# Altium schematic sheet Power.SchDoc
size 279 x 215 mm; Engineer: Andrew Chai
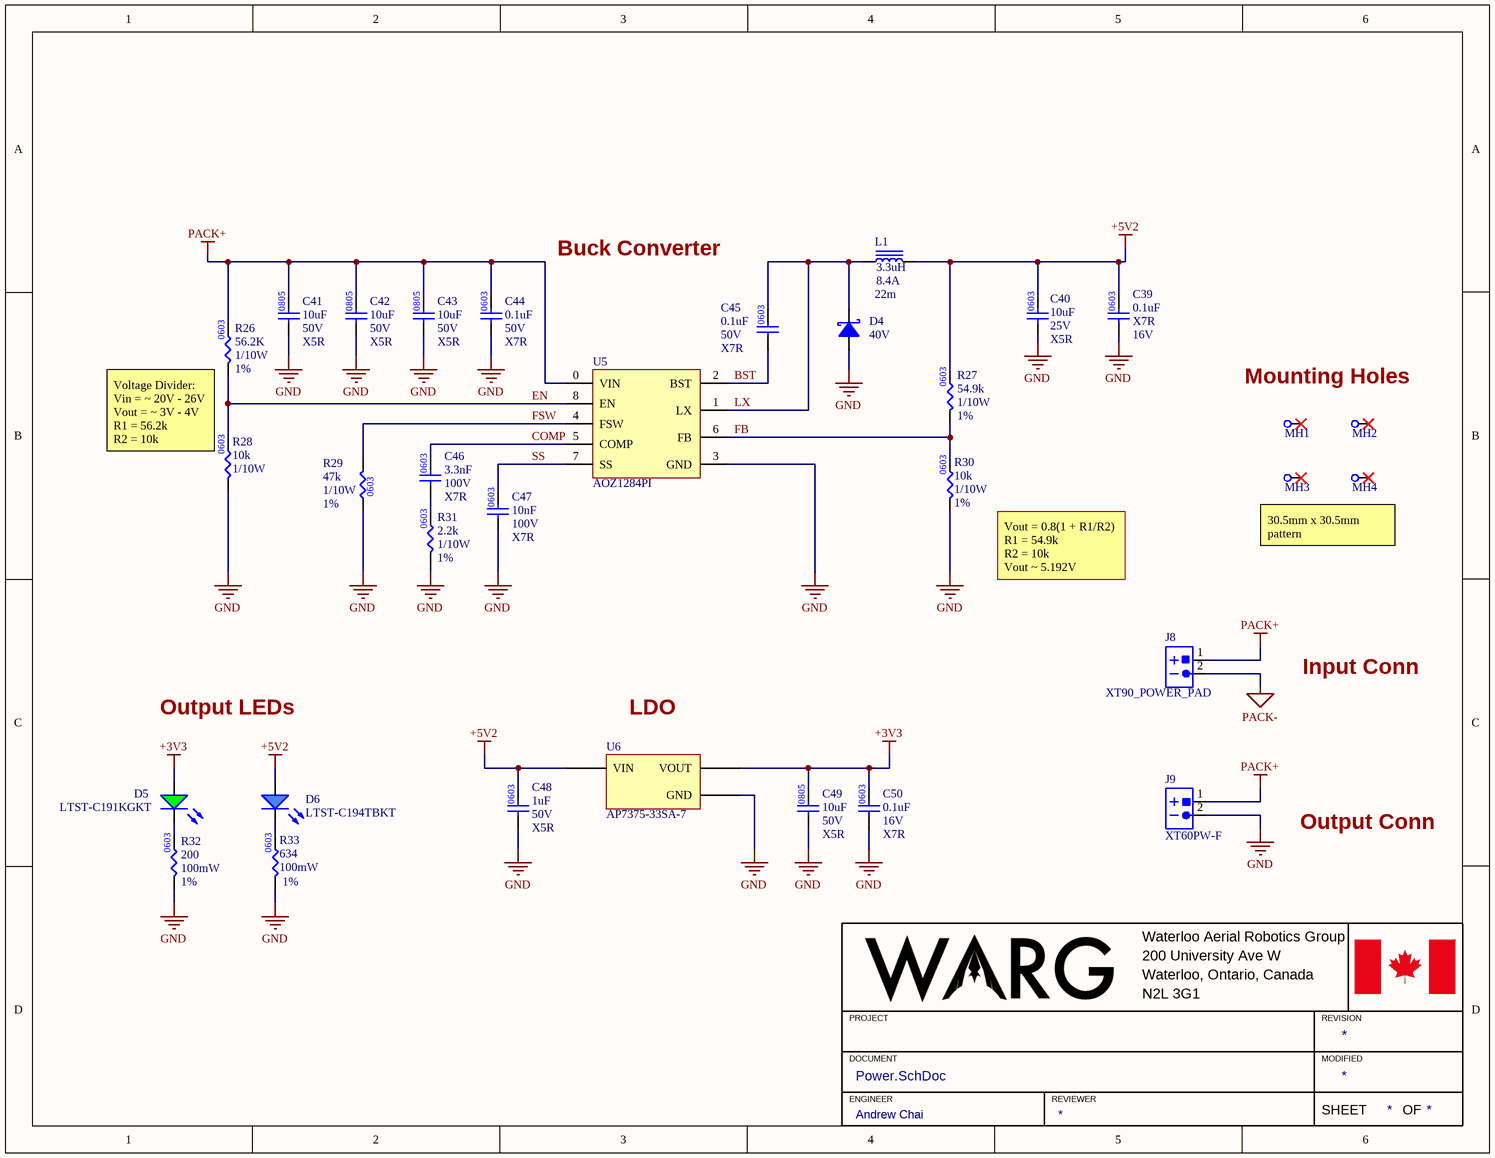
[diagram p0: Power.SchDoc]

## Parts
C39  value 0.1uF  Temperature Coefficient: X7R  Voltage: 16V  [.CAP_0603-Footprint-1]  (hidden comment: GCM188R71C104KA37D)
C40  value 10uF  Voltage Rating: 25V  Temperature Coefficient: X5R  [.CAP_0603-Footprint-1]  (hidden comment: GRM188R61E106KA73J)
C41  value 10uF  Voltage Rating: 50V  Dielectric: X5R  [.CAP_0805-Footprint-1]  (hidden comment: GRM21BR61H106KE43L)
C42  value 10uF  Voltage Rating: 50V  Dielectric: X5R  [.CAP_0805-Footprint-1]  (hidden comment: GRM21BR61H106KE43L)
C43  value 10uF  Voltage Rating: 50V  Dielectric: X5R  [.CAP_0805-Footprint-1]  (hidden comment: GRM21BR61H106KE43L)
C44  Voltage: 50V  Dielectric: X7R  Capacitance: 0.1uF  [CAP0603]  (hidden comment: GCM188R71H104KA57D)
C45  Voltage: 50V  Dielectric: X7R  Capacitance: 0.1uF  [CAP0603]  (hidden comment: GCM188R71H104KA57D)
C46  value 3.3nF  Temperature Characteristics Code: X7R  Rated DC Voltage (URdc): 100V  [.CAP_0603-Footprint-1]  (hidden comment: GCM188R72A332KA37D)
C47  value 10nF  Rated DC Voltage (URdc): 100V  Temperature Characteristics Code: X7R  [CAP0603]  (hidden comment: GCM188R72A103KA37D)
C48  value 1uF  Voltage Rating: 50V  Temperature Characteristics Code: X5R  [.CAP_0603-Footprint-1]  (hidden comment: GRT188R61H105KE13D)
C49  value 10uF  Voltage Rating: 50V  Dielectric: X5R  [.CAP_0805-Footprint-1]  (hidden comment: GRM21BR61H106KE43L)
C50  value 0.1uF  Temperature Coefficient: X7R  Voltage: 16V  [.CAP_0603-Footprint-1]  (hidden comment: GCM188R71C104KA37D)
D4  Max Reverse Voltage (DC): 40V  [DIOM4426X24N]  (hidden comment: SK54A-LTP)
D5  LTST-C191KGKT  [.LED_0603-Footprint-1]
D6  LTST-C194TBKT  [LTST-C194TBKT-Footprint-1]
J8  XT90_POWER_PAD  [XT90_POWER_PAD-Footprint-1]
J9  XT60PW-F  [XT60PW-F-Footprint-1]
L1  DC Resistance: 22m  Current: 8.4A  Inductance: 3.3uH  [0630CDMCCDS-3R3MC-Footprint-1]  (hidden comment: 0630CDMCCDS-3R3MC)
MH1  M2HOLE-STANDARD  [M2HOLE-STANDARD-Footprint-1]  (value not drawn)
MH2  M2HOLE-STANDARD  [M2HOLE-STANDARD-Footprint-1]  (value not drawn)
MH3  M2HOLE-STANDARD  [M2HOLE-STANDARD-Footprint-1]  (value not drawn)
MH4  M2HOLE-STANDARD  [M2HOLE-STANDARD-Footprint-1]  (value not drawn)
R26  value 56.2K  Power: 1/10W  Tolerance: 1%  [.RES_0603-Footprint-1]  (hidden comment: RC0603FR-0756K2L)
R27  Power Rating: 1/10W  Resistance: 54.9k  Tolerance: 1%  [.RES_0603-Footprint-1]  (hidden comment: RC0603FR-0754K9L)
R28  value 10k  Power: 1/10W  [.RES_0603-Footprint-1]  (hidden comment: RC0603FR-0710KL)
R29  value 47k  POWER: 1/10W  TOLERANCE: 1%  [RC0603FR-0756K2L-Footprint-1]  (hidden comment: RC0603FR-0747KL)
R30  value 10k  Power: 1/10W  Tolerance: 1%  [.RES_0603-Footprint-1]  (hidden comment: RC0603FR-0710KL)
R31  value 2.2k  Resistance Tolerance: 1%  Max Power Dissipation: 1/10W  [.RES_0603-Footprint-1]  (hidden comment: RC0603FR-072K2L)
R32  Tolerance: 1%  Power Rating: 100mW  Resistance: 200  [.RES_0603-Footprint-1]  (hidden comment: RC0603FR-07200RL)
R33  value 634  Tolerance: 1%  Power: 100mW  [.RES_0603-Footprint-1]  (hidden comment: RC0603FR-07634RL)
U5  AOZ1284PI  [AOZ1284PI-Footprint-1]
U6  AP7375-33SA-7  [AP7375-33SA-7-Footprint-1]

## Nets
+3V3: C49.2 C50.2 D5.1(A) U6.2(VOUT)
+5V2: C39.2 C40.2 C48.2 D6.1(A) L1.2 R27.2 U6.1(VIN)
GND: C39.1 C40.1 C41.1 C42.1 C43.1 C44.1 C47.1 C48.1 C49.1 C50.1 D4.1(Anode) J9.2 R28.1 R29.1 R30.1 R31.1 R32.1 R33.1 U5.3(GND) U6.3(GND)
PACK+: C41.2 C42.2 C43.2 C44.2 J8.1 J9.1 R26.2 U5.0(VIN)
PACK-: J8.2
BST: C45.1 U5.2(BST)
COMP: C46.2 U5.5(COMP)
EN: R26.1 R28.2 U5.8(EN)
FB: R27.1 R30.2 U5.6(FB)
FSW: R29.2 U5.4(FSW)
LX: C45.2 D4.2(Cathode) L1.1 U5.1(LX)
SS: C47.2 U5.7(SS)
NetC46_1: C46.1 R31.2
NetD5_2: D5.2(K) R32.2
NetD6_2: D6.2(K) R33.2

Not connected (* = marked no-connect by the designer): MH1 1*; MH2 1*; MH3 1*; MH4 1*

## Notes on the sheet
- Buck Converter
- Mounting Holes
- Voltage Divider:
  Vin = ~ 20V - 26V
  Vout = ~ 3V - 4V
  R1 = 56.2k
  R2 = 10k
- 30.5mm x 30.5mm pattern
- (near R30) Vout = 0.8(1 + R1/R2)
  R1 = 54.9k
  R2 = 10k
  Vout ~ 5.192V
- Output LEDs
- (near U6) LDO
- Input Conn
- Output Conn
- Waterloo Aerial Robotics Group
- 200 University Ave W
- PROJECT
- Waterloo, Ontario, Canada
- N2L 3G1
- REVISION
- DOCUMENT
- ENGINEER
- REVIEWER
- MODIFIED
- SHEET
- OF
- (in symbol CMP-00247-1) 0603

## Library data of the parts
C39 C50 = CMP-001-00020-5: CAP CER 0.1uF 16V X7R 0603; Capactitance: 0.1uF; Package: 0603
C40 = CMP-00056-4: CAP CER 10UF 25V X5R 0603; Case/Package: 0603
C41-C43 C49 = CMP-001-00009-4: CAP CER 10uF 50V X5R 0805; Voltage: 50V; Package: 0805; Capacitance: 10uF
C44 C45 = CMP-00047-2: CAP CER 0.1uF 50V X7R 0603; Tolerance: 10%; Mount: Surface Mount; Case Code (Imperial): 0603
C46 = CMP-001-00086-1: Ceramic Capacitor, Multilayer, Ceramic, 100V, 10% +Tol, 10% -Tol, X7R, 15% TC, 0.0033uF, Surface Mount, 0603; Multilayer: Yes; Reference Standard: AEC-Q200; Terminal Finish: Nickel; Termination: Wraparound; Capacitor Type: Ceramic; Width: 0.8mm; Dielectric Material: Ceramic; JESD-609 Code: e3; Tolerance (fill in as +-): 10%; Mounting Technology: Surface Mount; Tolerance  (fill in as +-): 10%; Max Operating Temperature: 125°C; Package Shape: Rectangular; Length: 1.6mm; Packaging: Tape and Reel; Pins: 2; Height: 0.9mm; Package Style: SMTMeter; RoHS Compliant: Yes; Min Operating Temperature: -55°C; Case/Package: 0603; Reach SVHC Compliant: Yes
C47 = CMP-00247-1: CAP CER 10000PF 100V X7R 0603; Tolerance: 10%
C48 = CMP-00096-3: CAP CER 1UF 50V X5R 0603; Tolerance: 10%; Capacitor Type: Ceramic; Dielectric: X5R; Mount: Surface Mount; Capacitance: 1uF; Case/Package: 0603; Rated DC Voltage (URdc): 50V
D4 = CMP-00102-3: Diode Schottky 40V 5A 2-Pin SMA T/R; Case/Package: SMA; Average Rectified Current: 5A
D5 = CMP-001-00018-6: LED GREEN 2V 0603; Forward Current: 20mA; Case/Package: 0603; Forward Voltage: 2V; Color: Green
D6 = CMP-00017-2: LED BLUE CLEAR 0603 SMD; Lens Style: Flat,Diffused,Colorless,Rectangular; Lens Size: 0.8mm; Lens Color: Colorless; Test Current: 5mA; Forward Voltage: 2.8V; Number of Elements: 1; Voltage: 29V; Viewing Angle: 130°; Reverse Voltage: 5V; Dominant Wavelength: 473nm; Power Dissipation: 76mW; Forward Current: 20mA; Luminous Intensity: 15mcd; Length: 1.6mm; Depth: 0.8mm; Radiation Hardening: No; Height: 0.65mm; Lens Transparency: Clear; Number of Pins: 2; Case/Package: 0603; Illumination Color: Blue; Case Code (Imperial): 0603; RoHS Compliant: Yes; Mount: Surface Mount; Color: Blue; Width: 0.8mm; Packaging: Tape and Reel; Max Operating Temperature: 80°C; Number of LEDs: 1; Lead Free: Lead Free; Min Operating Temperature: -20°C; Package Quantity: 5000; Case Code (Metric): 1608; Series: -
J8 = CMP-001-0016-1: XT90_POWER_PAD, 4.5mm Square Pad, 6.5mm Pitch
J9 = CMP-00086-5: Board Mount XT60PW-F 2 Pin Female Connector; Manufacturer: TME
L1 = CMP-006-00015-1: General Purpose Inductor, 3.3uH, 20%, 1 Element, SMD; Tolerance: +/- 20%; Saturation Current: 11.4A; Inductor Type: GENERAL PURPOSE INDUCTOR; RoHS Compliant: Yes
MH1-MH4 = CMP-00092-5: RFC in progress (Dimensions currently unapproved); Annular Ring Diameter: 4.2mm; Through Hole Diameter: 2.4mm
R26 = CMP-009-00046-1: RES 56.2K OHM 1% 1/10W 0603; Resistance: 56.2k; Package: 0603
R27 = CMP-001-00025-1: RES 54.9k OHM 1% 1/10@ 0603; Voltage Rating: 50V; Case/Package: 0603
R28 R30 = CMP-009-00006-4: RES 10K OHM 1% 1/10W 0603; Resistance: 10k; Package: 0603
  R28: Tolerance: 1%
R29 = CMP-009-00091-1: RES 47K OHM 1% 1/10W 0603; Package Width: 0.8mm; Working Voltage: 75V; Temperature Coefficient: 100ppm/°C; Rated Temperature: 70°C; Package Length: 1.6mm; Package Height: 0.45mm; Additional Feature: LASER TRIMMABLE; Packaging: Tape and Reel; Construction: Chip; Package Shape: Rectangular; Technology: METAL GLAZE/THICK FILM; JESD-609 Code: e3; Max Operating Temperature: 155°C; Package Style: SMTMeter; Reach SVHC Compliant: Yes; Min Operating Temperature: -55°C; Termination: Wraparound; Case/Package: 0603; Resistor Type: FIXED RESISTOR; Terminal Finish: Nickel; RoHS Compliant: Yes; Mounting Technology: Surface Mount; Pins: 2
R31 = CMP-009-00022-2: RES 2.2K OHM 0603 1/10W; Voltage Rating: 50V; Case/Package: 0603
R32 = CMP-00103-1: RES 200 OHM 1% 1/10W 0603; Voltage Rating: 50V; Case/Package: 0603
R33 = CMP-00251-1: RES 634 OHM 1% 1/10W 0603; Case/Package: 0603
U5 = CMP-00257-2: IC REG BUCK ADJUSTABLE 4A 8SO; Manufacturer 1: Alpha & Omega Semiconductor Inc.; Supplier 1: Digikey; Manufacturer Part Number 1: AOZ1284PI; Supplier Part Number 1: 785-1689-1-ND
U6 = CMP-002-000009-1: IC REG LIN 3.3V 300MA SOT23-3; Output Type: Fixed; Voltage - Input (Max): 45V; Voltage Dropout (Max): 0.36V @ 100mA; Current - Quiescent (Iq): 5 µA; Operating Temperature: -40°C ~ 125°C (TJ); Voltage - Output (Min/Fixed): 3.3V; Supplier Device Package: SOT-23-3; Current - Output: 300mA